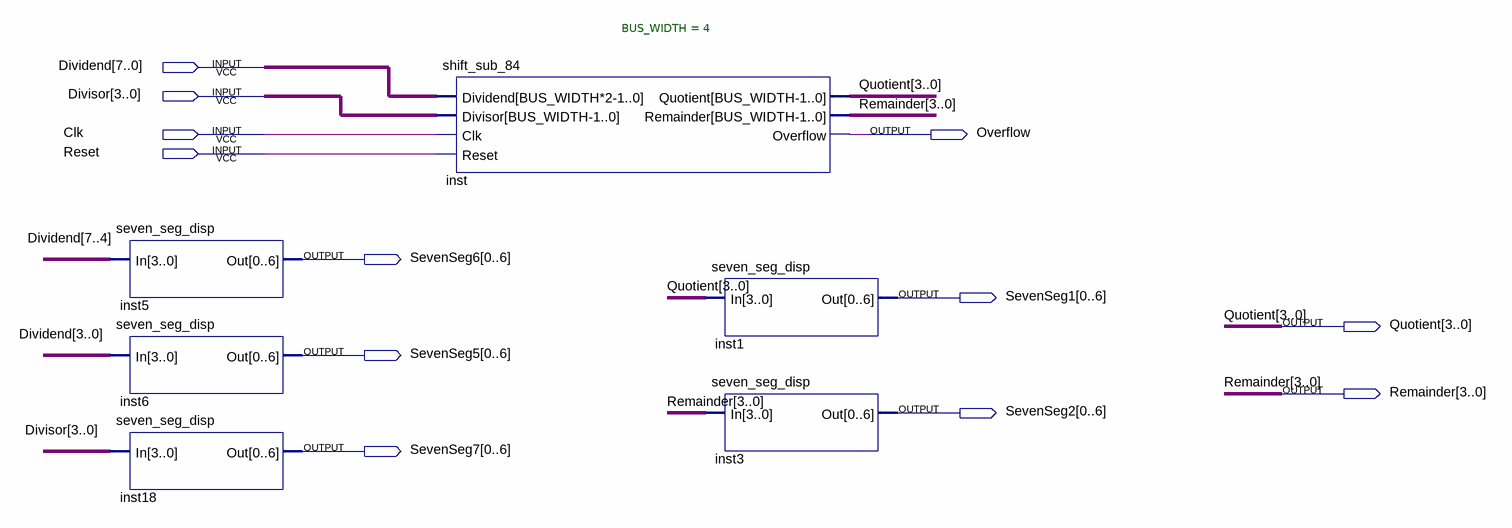
[diagram p0: schematic sheet]
// Quartus schematic shift_sub_div_full.bdf as structural Verilog: 6 symbols, 12 pins
module shift_sub_div_full (
  input  [7:0] Dividend,
  input  [3:0] Divisor,
  input  Clk,
  input  Reset,
  output Overflow,
  output [0:6] SevenSeg6,
  output [0:6] SevenSeg1,
  output [3:0] Quotient,
  output [0:6] SevenSeg5,
  output [3:0] Remainder,
  output [0:6] SevenSeg2,
  output [0:6] SevenSeg7
);

  seven_seg_disp inst5 (.In(Dividend[7:4]), .Out(SevenSeg6));
  seven_seg_disp inst6 (.In(Dividend[3:0]), .Out(SevenSeg5));
  seven_seg_disp inst18 (.In(Divisor), .Out(SevenSeg7));
  shift_sub_84 #(.BUS_WIDTH(4)) inst (
    .Dividend(Dividend), .Divisor(Divisor), .Clk(Clk), .Reset(Reset), .Quotient(Quotient),
    .Remainder(Remainder), .Overflow(Overflow));
  seven_seg_disp inst1 (.In(Quotient), .Out(SevenSeg1));
  seven_seg_disp inst3 (.In(Remainder), .Out(SevenSeg2));
endmodule
